# EAGLE design output_stage_sn74hc595n (EAGLE 7.6.0)
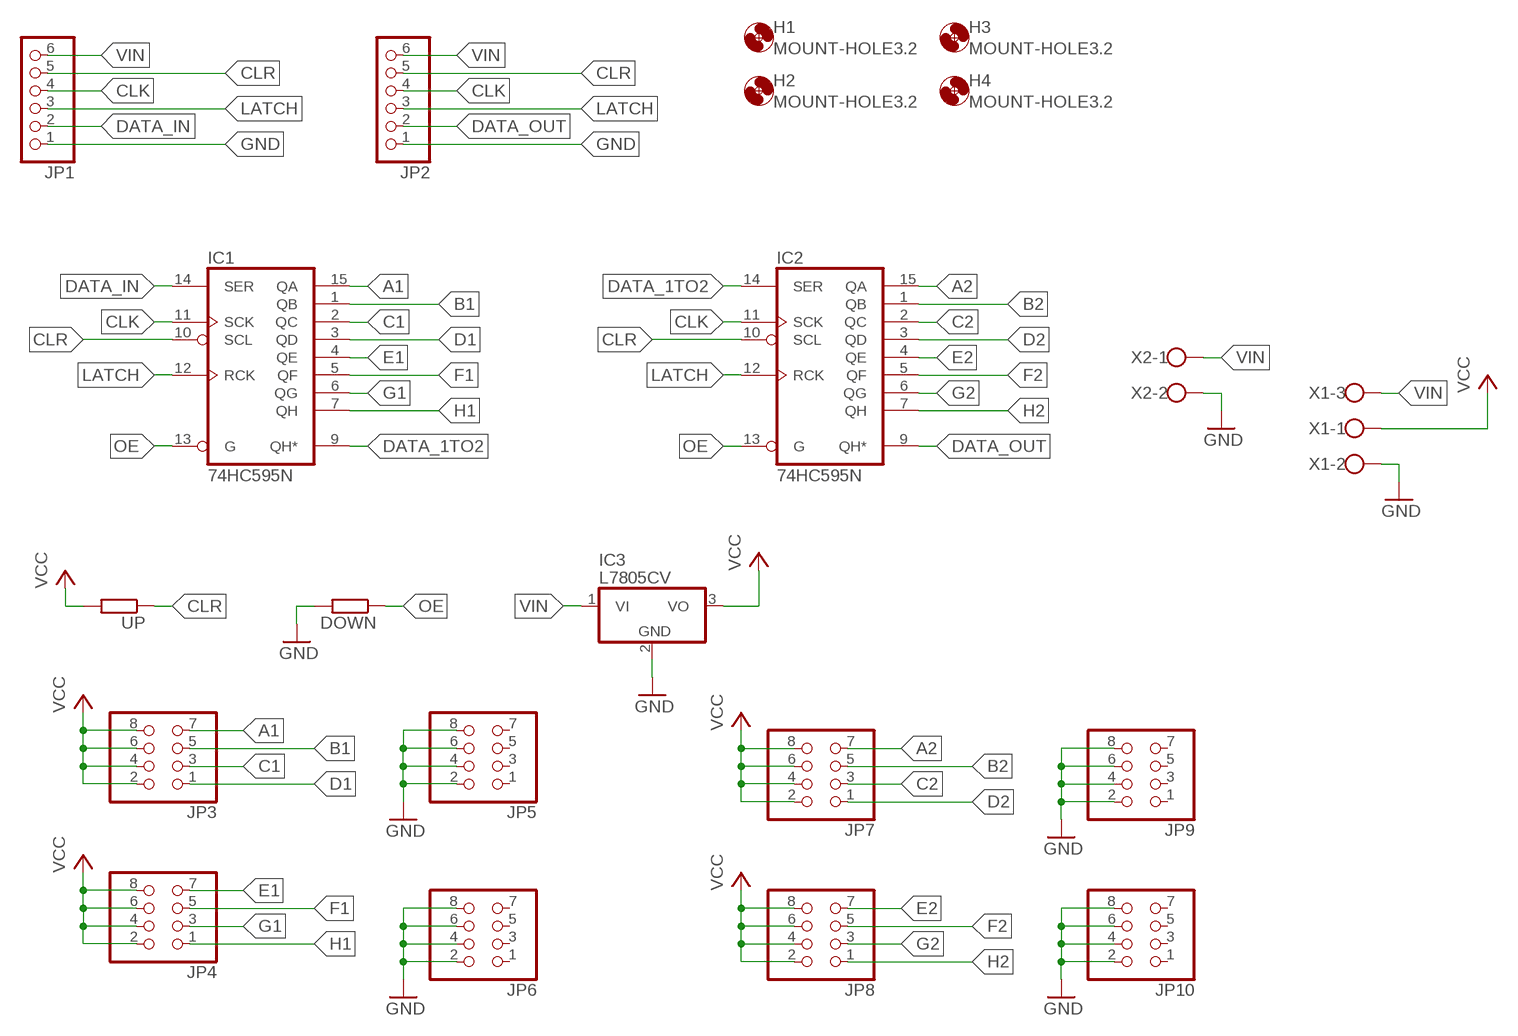
[diagram p0: schematic, sheet 1]

## Parts
DOWN  R-EU_0207/10  [0207/10]
H1  MOUNT-HOLE3.2  [3,2]
H2  MOUNT-HOLE3.2  [3,2]
H3  MOUNT-HOLE3.2  [3,2]
H4  MOUNT-HOLE3.2  [3,2]
IC1  74HC595N  [DIL16]
IC2  74HC595N  [DIL16]
IC3  L7805CV  7805TV  [TO220V]
JP1  PINHD-1X6  [1X06]
JP2  PINHD-1X6  [1X06]
JP3  PINHD-2X4  [2X04]
JP4  PINHD-2X4  [2X04]
JP5  PINHD-2X4  [2X04]
JP6  PINHD-2X4  [2X04]
JP7  PINHD-2X4  [2X04]
JP8  PINHD-2X4  [2X04]
JP9  PINHD-2X4  [2X04]
JP10  PINHD-2X4  [2X04]
UP  R-EU_0207/10  [0207/10]
X1  W237-103  [W237-103]
X2  W237-102  [W237-102]

## Nets
A1: IC1.15(QA) JP3.7
A2: IC2.15(QA) JP7.7
B1: IC1.1(QB) JP3.5
B2: IC2.1(QB) JP7.5
C1: IC1.2(QC) JP3.3
C2: IC2.2(QC) JP7.3
CLK: IC1.11(SCK) IC2.11(SCK) JP1.4 JP2.4
CLR: IC1.10(SCL) IC2.10(SCL) JP1.5 JP2.5 UP.1
D1: IC1.3(QD) JP3.1
D2: IC2.3(QD) JP7.1
DATA_1TO2: IC1.9(QH*) IC2.14(SER)
DATA_IN: IC1.14(SER) JP1.2
DATA_OUT: IC2.9(QH*) JP2.2
E1: IC1.4(QE) JP4.7
E2: IC2.4(QE) JP8.7
F1: IC1.5(QF) JP4.5
F2: IC2.5(QF) JP8.5
G1: IC1.6(QG) JP4.3
G2: IC2.6(QG) JP8.3
GND: DOWN.2 IC3.2(GND) JP1.1 JP2.1 JP5.2 JP5.4 JP5.6 JP5.8 JP6.2 JP6.4 JP6.6 JP6.8 JP9.2 JP9.4 JP9.6 JP9.8 JP10.2 JP10.4 JP10.6 JP10.8 X1.2 X2.2
H1: IC1.7(QH) JP4.1
H2: IC2.7(QH) JP8.1
LATCH: IC1.12(RCK) IC2.12(RCK) JP1.3 JP2.3
OE: DOWN.1 IC1.13(G) IC2.13(G)
VCC: IC3.3(VO) JP3.2 JP3.4 JP3.6 JP3.8 JP4.2 JP4.4 JP4.6 JP4.8 JP7.2 JP7.4 JP7.6 JP7.8 JP8.2 JP8.4 JP8.6 JP8.8 UP.2 X1.1
VIN: IC3.1(VI) JP1.6 JP2.6 X1.3 X2.1
Unconnected: JP5.1 JP5.3 JP5.5 JP5.7 JP6.1 JP6.3 JP6.5 JP6.7 JP9.1 JP9.3 JP9.5 JP9.7 JP10.1 JP10.3 JP10.5 JP10.7

## Power pins joined to a net without a drawn wire
GND: IC1.8(GND) IC2.8(GND)
VCC: IC1.16(VCC) IC2.16(VCC)

## Library data of the parts
DOWN UP = resistor:R-EU_: RESISTOR, European symbol
H1-H4 = holes:MOUNT-HOLE: MOUNTING HOLE with drill center marker
IC1 IC2 = 74xx-eu:74*595: 8-bit SHIFT REGISTER, output latch
IC3 = linear:78*: Positive VOLTAGE REGULATOR Source: http://cache.national.com/ds/LM/LM78L05.pdf http://www.fairchildsemi.com/ds/LM/LM7805.pdf
JP1 JP2 = pinhead:PINHD-1X6: PIN HEADER
JP3-JP10 = pinhead:PINHD-2X4: PIN HEADER
X1 = con-wago-500:W237-103: WAGO SCREW CLAMP; MPN: 237-103; OC_FARNELL: unknown; OC_NEWARK: 18M7116
X2 = con-wago-500:W237-102: WAGO SCREW CLAMP; MPN: 237-102; OC_FARNELL: unknown; OC_NEWARK: 70K9898

## Board
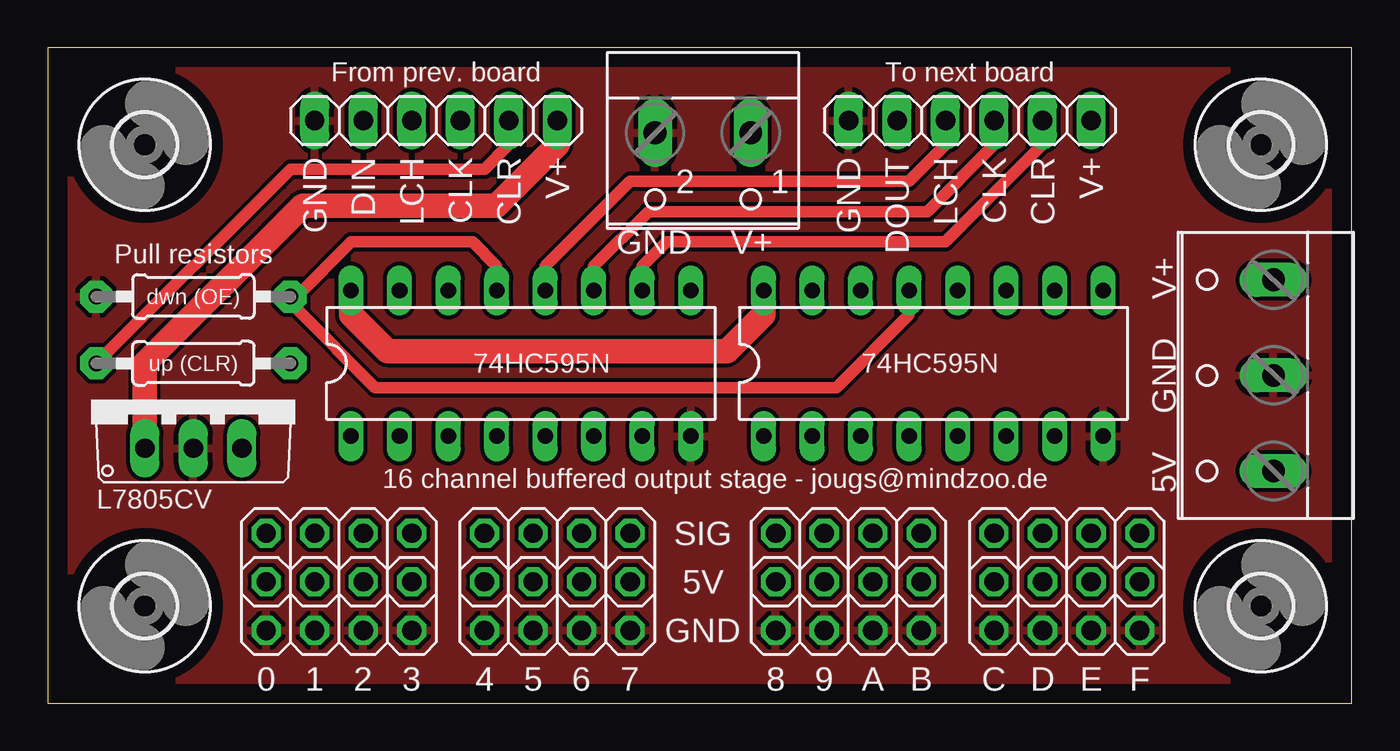
[diagram p1: board, top side]
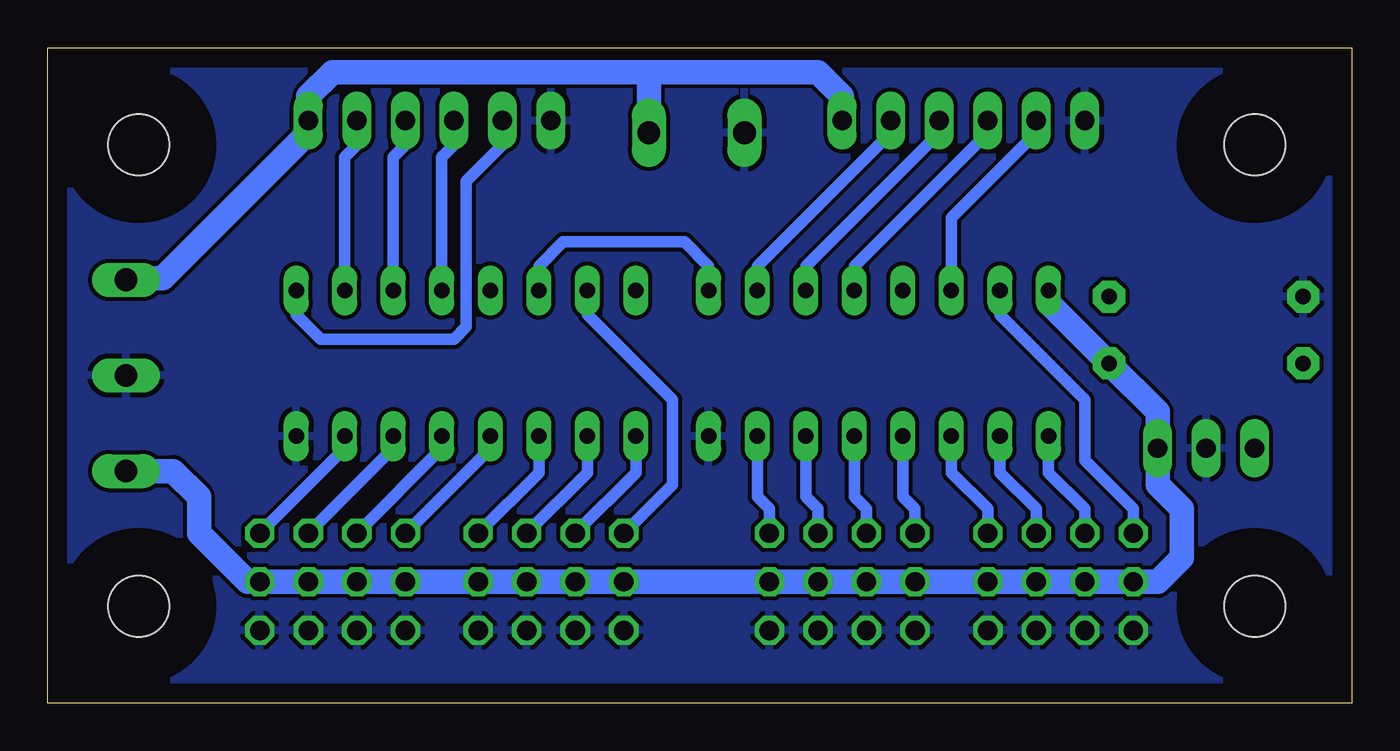
[diagram p2: board, bottom side, seen from below]

Size 68.25 x 34.28 mm. Coordinates in mm from the lower left corner, seen from the top.
Outline: 0,0 68.25,0 68.25,34.28 0,34.28 0,0
Copper layers (1*16): Top 0.035mm / dielectric 1.5mm / Bottom 0.035mm
Design rules "default": minimum track width 10mil, minimum drill 24mil, track to track 8mil, track to pad 8mil, pad to pad 8mil, via to via 8mil, smd to smd 8mil, copper to edge 40mil, drill to drill 8mil, minimum pad ring 10mil, minimum via ring 8mil, stop-mask expansion 4mil, vias tented up to drill 0mil, thermal gap 10mil

### Footprints (pad centres in the part's own frame; a part is rotated, then mirrored left to right if it is on the bottom)
0207/10 = drill 0.813 pad 1.676 octagon: 1 -5.08,0; 2 5.08,0
3,2 = hole 3.2: 0,0
DIL16 = drill 0.813 long: 1 -8.89,-3.81; 2 -6.35,-3.81; 3 -3.81,-3.81; 4 -1.27,-3.81; 5 1.27,-3.81; 6 3.81,-3.81; 7 6.35,-3.81; 8 8.89,-3.81; 9 8.89,3.81; 10 6.35,3.81; 11 3.81,3.81; 12 1.27,3.81; 13 -1.27,3.81; 14 -3.81,3.81; 15 -6.35,3.81; 16 -8.89,3.81
TO220V = drill 1.016 long: 1 -2.54,-2.54; 2 0,-2.54; 3 2.54,-2.54
1X06 = drill 1.016 long: 1 -6.35,0; 2 -3.81,0; 3 -1.27,0; 4 1.27,0; 5 3.81,0; 6 6.35,0
2X04 = drill 1.016 octagon: 1 -3.81,-1.27; 2 -3.81,1.27; 3 -1.27,-1.27; 4 -1.27,1.27; 5 1.27,-1.27; 6 1.27,1.27; 7 3.81,-1.27; 8 3.81,1.27
W237-103 = drill 1.194 long: 1 -5,-1.29; 2 0,-1.29; 3 5,-1.29
W237-102 = drill 1.194 long: 1 -2.5,-1.27; 2 2.5,-1.27

### Placement (x,y rotation side)
DOWN  7.62,21.27 180 top
H1  5.08,5.08 0 top
H2  63.5,5.08 0 top
H3  5.08,29.21 0 top
H4  63.5,29.21 0 top
IC1  24.77,17.78 0 top
IC2  46.35,17.78 0 top
IC3  7.62,15.88 0 top
JP1  20.32,30.48 0 top
JP2  48.26,30.48 0 top
JP3  15.24,7.62 180 top
JP4  26.67,7.62 180 top
JP5  15.24,5.08 180 top
JP6  26.67,5.08 180 top
JP7  41.91,7.62 180 top
JP8  53.34,7.62 180 top
JP9  41.91,5.08 180 top
JP10  53.34,5.08 180 top
UP  7.62,17.78 0 top
X1  62.87,17.14 90 top
X2  34.29,28.57 180 top

### Tracks (layer width: path | path; a pad name or v marks a point on that pad's centre or on a via)
A1
  Bottom 0.61: IC1.15 18.41,20.32 13.97,15.88 13.97,12.7 11.43,10.16 JP3.7
A2
  Bottom 0.61: JP7.7 35.56,11.43 35.56,15.88 40.01,20.32 IC2.15
B1
  Bottom 0.61: IC1.1 15.88,12.06 13.97,10.16 JP3.5
B2
  Bottom 0.61: IC2.1 37.47,12.06 JP7.5
C1
  Bottom 0.61: IC1.2 18.41,12.06 16.51,10.16 JP3.3
C2
  Bottom 0.61: IC2.2 40.01,12.06 JP7.3
CLK
  Top 0.61: JP2.4 49.53,29.21 46.04,25.72 31.43,25.72 28.57,22.86 IC1.11
  Bottom 0.61: JP1.4 21.59,29.84 28.57,22.86 IC1.11 | JP2.4 49.53,29.21 50.16,28.57 IC2.11
CLR
  Top 0.61: UP.1 12.7,27.94 22.86,27.94 24.13,29.21 JP1.5 | JP2.5 52.07,29.21 46.99,24.13 32.38,24.13 31.11,22.86 IC1.10
  Bottom 0.61: JP1.5 24.13,29.84 31.11,22.86 IC1.10 | JP2.5 52.07,29.21 52.7,28.57 IC2.10
D1
  Bottom 0.61: IC1.3 20.95,12.06 19.05,10.16 JP3.1
D2
  Bottom 0.61: IC2.3 42.55,12.06 JP7.1
DATA_1TO2
  Bottom 0.61: IC1.9 33.66,22.86 34.92,24.13 41.27,24.13 42.55,22.86 IC2.14
DATA_IN
  Bottom 0.61: JP1.2 16.51,29.84 20.95,25.4 IC1.14
DATA_OUT
  Bottom 0.61: IC2.9 55.24,20.32 53.98,19.05 46.99,19.05 46.35,19.68 46.35,27.3 44.45,29.21 JP2.2
E1
  Bottom 0.61: IC1.4 23.5,10.79 22.86,10.16 JP4.7
E2
  Bottom 0.61: IC2.4 45.09,13.34 JP8.7
F1
  Bottom 0.61: IC1.5 26.04,10.79 25.4,10.16 JP4.5
F2
  Bottom 0.61: IC2.5 47.62,13.34 JP8.5
G1
  Bottom 0.61: IC1.6 28.57,10.79 27.94,10.16 JP4.3
G2
  Bottom 0.61: IC2.6 50.16,13.34 JP8.3
GND
  pour Bottom: 0,0 68.58,0 68.58,34.29 0,34.29
  pour Top: 0,0 68.58,0 71.12,34.29 0,34.29
H1
  Bottom 0.61: IC1.7 31.11,10.79 30.48,10.16 JP4.1
H2
  Bottom 0.61: IC2.7 52.7,13.34 JP8.1
LATCH
  Top 0.61: IC1.12 26.04,22.86 30.48,27.3 45.09,27.3 46.99,29.21 JP2.3
  Bottom 0.61: JP2.3 46.99,29.21 47.62,28.57 IC2.12 | JP1.3 19.05,29.84 26.04,22.86 IC1.12
OE
  Top 0.61: IC1.13 23.5,22.86 22.23,24.13 15.88,24.13 13.02,21.27 | IC2.13 45.09,20.32 41.27,16.51 17.14,16.51 13.02,20.64 13.02,21.27 | DOWN.1 13.02,21.27
VCC
  Top 1.27: IC2.16 37.47,20.32 35.56,18.41 17.78,18.41 15.88,20.32 IC1.16
  Bottom 1.016: 15.88,20.95 IC1.16 | JP8.2 57.78,6.35
  Bottom 1.27: 15.88,20.95 UP.2 10.16,15.24 IC3.3 10.16,11.43 8.89,10.16 8.89,7.62 10.16,6.35 JP3.8 JP3.6 JP3.4 JP3.2 JP4.8 JP4.6 JP4.4 JP4.2 JP7.8 JP7.6 JP7.4 JP7.2 JP8.8 JP8.6 JP8.4 JP8.2 | 57.78,6.35 60.33,8.89 60.33,10.79 61.67,12.14 X1.1
VIN
  Top 1.27: IC3.1 5.08,17.78 13.34,26.04 23.5,26.04 26.67,29.21 JP1.6
  Bottom 1.27: X1.3 64.08,22.23 62.23,22.23 54.61,29.84 JP2.6 54.61,31.75 53.34,33.02 36.83,33.02 | JP1.6 26.67,31.75 27.94,33.02 36.83,33.02 | X2.1 36.79,32.98 36.83,33.02

### Text on the board
tNames: From prev. board | To next board | GND | DIN | LCH | CLK | CLR | V+ | GND | DOUT | LCH | CLK | CLR | V+ | GND | V+ | Pull resistors | V+ | dwn (OE) | up (CLR) | GND | 16 channel buffered output stage - jougs@mindzoo.de | 5V | SIG | 5V | GND | 0 | 1 | 2 | 3 | 4 | 5 | 6 | 7 | 8 | 9 | A | B | C | D | E | F